# Altium schematic sheet BQ25570.SchDoc: BQ25570 Schematic
size A4; DrawnBy: Shuran Xu; SheetNumber: 5; SheetTotal: 8
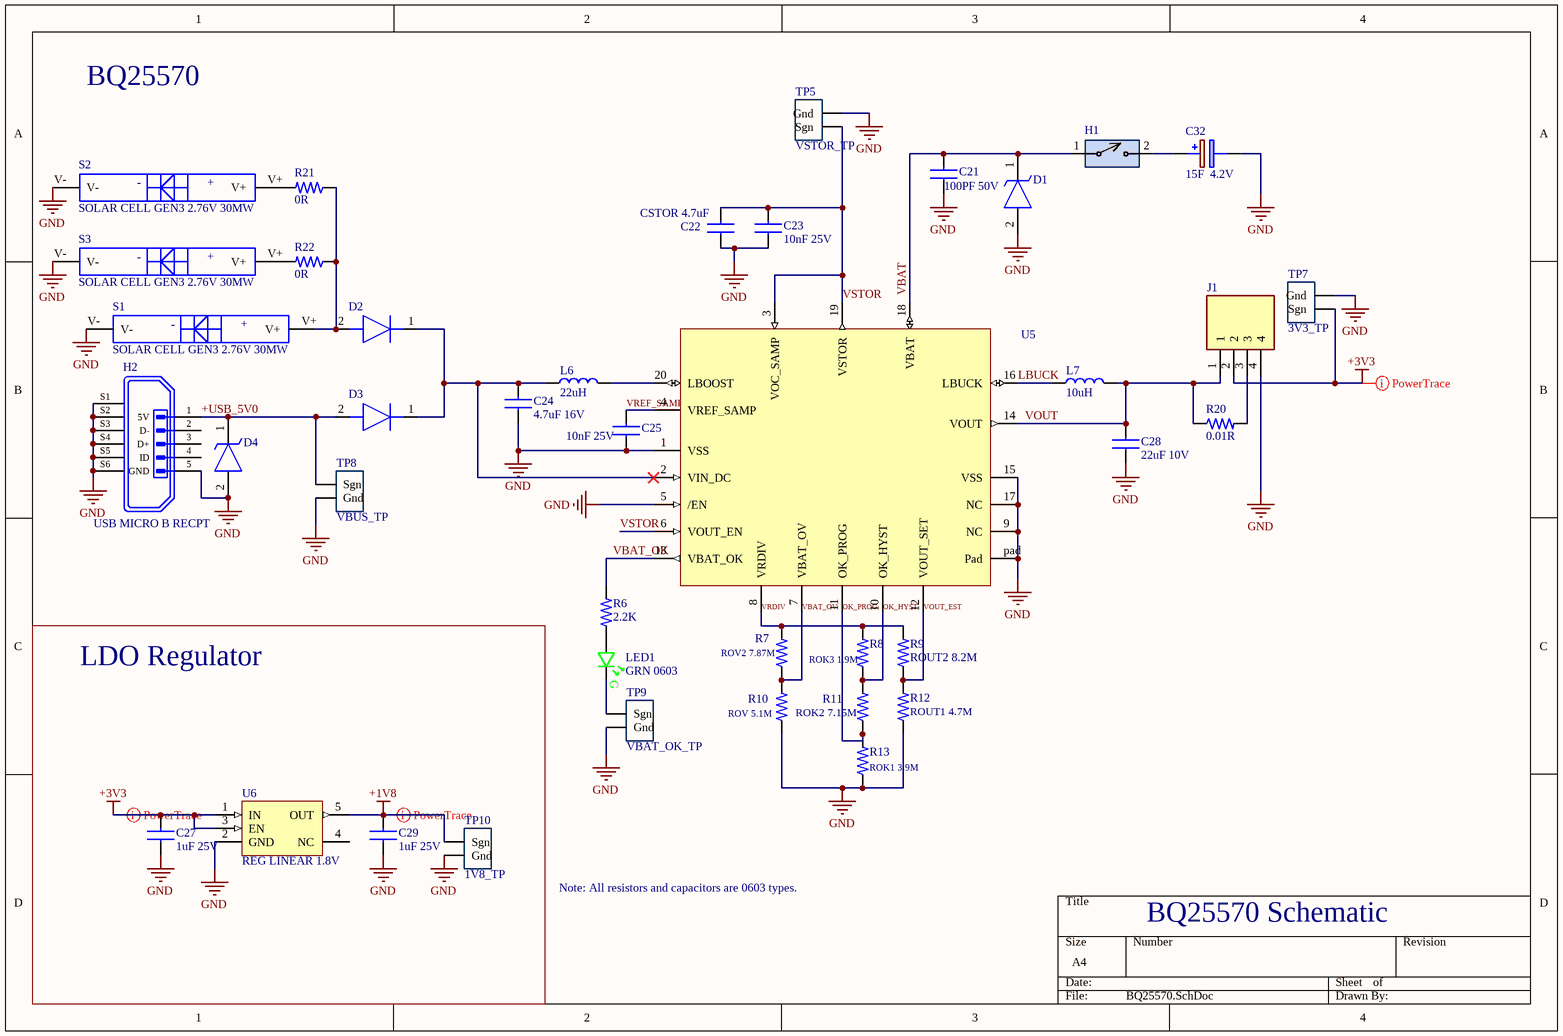
[diagram p0: BQ25570.SchDoc]

## Parts
C21  100PF 50V  [Chip2Pin_1.6x0.8x0.9_CAP]
C22  CSTOR 4.7uF  [Chip2Pin_CAP_2_1.6x0.8]
C23  10nF 25V  [Chip2Pin_1.6x0.8x0.9_CAP]
C24  4.7uF 16V  [Chip2Pin_1.6x0.8x0.9_CAP]
C25  10nF 25V  [Chip2Pin_1.6x0.8x0.9_CAP]
C27  1uF 25V  [Chip2Pin_1.6x0.8x0.9_CAP]
C28  22uF 10V  [CAP_0603_1MM]
C29  1uF 25V  [Chip2Pin_1.6x0.8x0.9_CAP]
C32  15F  4.2V  [MAL219691204E3]
D1  TVS DIODE 5.5VWM 12VC SOD923  [SODFL1006X40N]  (value not drawn)
D2  DIODE SCHOTTKY 10V 3A SOD323-2  [SOD2513X110N]  (value not drawn)
D3  DIODE SCHOTTKY 10V 3A SOD323-2  [SOD2513X110N]  (value not drawn)
D4  TVS DIODE 5.5VWM 12VC SOD923  [SODFL1006X40N]  (value not drawn)
H1  CONN HEADER VERT 2POS 2.54MM  [2-PIN_MALE_HEADER_01-IN]  (value not drawn)
H2  USB MICRO B RECPT  [MICROUSB_AMPHENOL_10118194-0001LF]
J1  Headers & Wire Housings 4P SINGLE ROW  [HDRV4W63P0X254_1X4_1016X250X950P]  (value not drawn)
L6  22uH  [IND_3030x12]
L7  10uH  [IND_2828x30]
LED1  GRN 0603  [LED_0603_GRN_WL-SMCW]
R6  2.2K  [RES_0603_1608X06]
R7  ROV2 7.87M  [RES_0603_1608X06]
R8  ROK3 1.9M  [RES_0603_1608X06]
R9  ROUT2 8.2M  [RES_0603_1608X06]
R10  ROV 5.1M  [RES_0603_1608X06]
R11  ROK2 7.15M  [RES_0603_1608X06]
R12  ROUT1 4.7M  [RES_0603_1608X06]
R13  ROK1 3.9M  [RES_0603_1608X06]
R20  0.01R  [RES_0603_1608X06]
R21  0R  [RES_0603_1608X06]
R22  0R  [RES_0603_1608X06]
S1  SOLAR CELL GEN3 2.76V 30MW  [KXOB25-03X4F]
S2  SOLAR CELL GEN3 2.76V 30MW  [KXOB25-03X4F]
S3  SOLAR CELL GEN3 2.76V 30MW  [KXOB25-03X4F]
TP5  VSTOR_TP  [TP10x_Probe]
TP7  3V3_TP  [TP10x_Probe]
TP8  VBUS_TP  [TP10x_Probe]
TP9  VBAT_OK_TP  [TP10x_Probe]
TP10  1V8_TP  [TP10x_Probe]
U5  IC ENERGY HARV CTRLR BATT 20VQFN  [QFN_20_3.5X3.5]  (value not drawn)
U6  REG LINEAR 1.8V  [SOT23_5_2.9X1.6]

## Blocks framed on the sheet
LDO Regulator: C27 C29 TP10 U6

## Nets
+1V8: C29.1 TP10.1(Sgn) U6.5(OUT)
+3V3: C27.1 J1.2 TP7.1(Sgn) U6.1(IN) U6.3(EN)
GND: C21.2 C22.2 C23.2 C24.2 C25.2 C27.2 C28.2 C29.2 C32.2(-) D1.2(A) D4.2(A) H2.5(GND) H2.S1 H2.S2 H2.S3 H2.S4 H2.S5 H2.S6 J1.4 R10.1 R12.1 R13.1 S1.V- S2.V- S3.V- TP5.2(Gnd) TP7.2(Gnd) TP8.2(Gnd) TP9.2(Gnd) TP10.2(Gnd) U5.1(VSS) U5.5(/EN) U5.9(NC) U5.15(VSS) U5.17(NC) U5.pad(Pad) U6.2(GND)
+USB_5V0: D3.2(A) D4.1(K) H2.1(5V) TP8.1(Sgn)
LBUCK: L7.1 U5.16(LBUCK)
OK_HYST: R8.1 R11.2 U5.10(OK_HYST)
OK_PROG: R11.1 R13.2 U5.11(OK_PROG)
VBAT: C21.1 D1.1(K) H1.1 U5.18(VBAT)
VBAT_OK: R6.2 U5.13(VBAT_OK)
VBAT_OV: R7.1 R10.2 U5.7(VBAT_OV)
VOUT: C28.1 J1.1 L7.2 R20.1 U5.14(VOUT)
VOUT_EST: R9.1 R12.2 U5.12(VOUT_SET)
VRDIV: R7.2 R8.2 R9.2 U5.8(VRDIV)
VREF_SAMP: C25.1 U5.4(VREF_SAMP)
VSTOR: C22.1 C23.1 TP5.1(Sgn) U5.3(VOC_SAMP) U5.6(VOUT_EN) U5.19(VSTOR)
NetC24_1: C24.1 D2.1(K) D3.1(K) L6.1 U5.2(VIN_DC)
NetC32_1: C32.1(+) H1.2
NetD2_2: D2.2(A) R21.1 R22.1 S1.V+
NetJ1_3: J1.3 R20.2
NetL6_2: L6.2 U5.20(LBOOST)
NetLED1_A: LED1.A R6.1
NetLED1_C: LED1.C TP9.1(Sgn)
NetR21_2: R21.2 S2.V+
NetR22_2: R22.2 S3.V+

Not connected (* = marked no-connect by the designer): H2 2(D-) 3(D+) 4(ID); U6 4(NC)

## Layout directives
rule Width Constraint [Pref Width = 20mil    Min Width = 10mil    Max Width = 20mil]: +1V8, +3V3

## Notes on the sheet
- BQ25570
- Note: All resistors and capacitors are 0603 types.
- (in symbol 150060GS75000) G
- (in symbol KXOB25-03X4F-TR) -; +

## Library data of the parts
C21 = GRM1885C1H101JA01J: 0603 100 pF 50 V ±5% Tolerance C0G SMT Multilayer Ceramic Capacitor; Manufacturer: Murata; Supplier 1: Arrow Electronics; Manufacturer Part Number: GRM1885C1H101JA01J; RoHS: Yes; Category: Ceramic Capacitors; Stock 1: 97512; Pricing 1: 1=0.01350 (USD); Mounting Technology: Surface Mount; Case/Package: 0603; Case Code (Imperial): 0603; Case Code (Metric): 1608; Min Operating Temperature: -55°C; Max Operating Temperature: 125°C; Value: 100pF; Voltage Rating: 50V; Voltage Rating (DC): 50V; Tolerance: 5%; Packaging: Tape and Reel; Package Quantity: 10000; Dielectric: C0G; Termination: SMD/SMT; Voltage: 50V; Series: GRM; Construction: Flat; Length: 1.6mm; Width: 0.8mm; Height: 0.8mm; Thickness: 0.035inch; Depth: 0.8mm; Size: 0.8mm; Radiation Hardening: No; Lead Free: Lead Free; RoHS Compliant: Yes; ComponentLink1URL: https://datasheet.ciiva.com/19467/1856644-19467772.pdf?src-supplier=Jameco; ComponentLink1Description: https://datasheet.ciiva.com/19467/1856644-19467772.pdf?src-supplier=Jameco; ComponentLink2URL: https://datasheet.ciiva.com/18100/getdatasheetpartid-26824-18100644.pdf?src-supplier=Verical; ComponentLink2Description: https://datasheet.ciiva.com/18100/getdatasheetpartid-26824-18100644.pdf?src-supplier=Verical; ComponentLink3URL: https://datasheet.ciiva.com/45259/partnumbering-e-01-45259466.pdf?src-supplier=Digi-Key; ComponentLink3Description: https://datasheet.ciiva.com/45259/partnumbering-e-01-45259466.pdf?src-supplier=Digi-Key; ComponentLink4URL: https://datasheet.ciiva.com/11605/product-11605547.pdf?src-supplier=Avnet; ComponentLink4Description: https://datasheet.ciiva.com/11605/product-11605547.pdf?src-supplier=Avnet; ComponentLink5URL: https://datasheet.ciiva.com/164/partnumbering-e-01-164252.pdf?src-supplier=Digi-Key; ComponentLink5Description: https://datasheet.ciiva.com/164/partnumbering-e-01-164252.pdf?src-supplier=Digi-Key
C22 C24 = GRM188Z71C475KE21D: Cap Ceramic 4.7uF 16V X7R 10% SMD 0603 125°C Paper T/R; Manufacturer: Murata; Supplier 1: Arrow Electronics; Manufacturer Part Number: GRM188Z71C475KE21D; RoHS: Yes; Category: Ceramic Capacitors; Stock 1: 80000; Pricing 1: 4000=0.05770, 8000=0.04270 (USD); RoHS Compliant: Yes
C23 C25 = GRT1885C1E103JA02J: Multi-Layer Ceramic Capacitor 0.01uF 25VDC C0G 5% 0603 Paper T/R; Manufacturer: Murata; Supplier 1: Future Electronics; Manufacturer Part Number: GRT1885C1E103JA02J; RoHS: Yes; Category: Ceramic Capacitors; Stock 1: 130000; Pricing 1: 10000=0.02340, 20000=0.02280, 30000=0.02250, 50000=0.02210, 100000=0.02130 (USD)
C27 C29 = GCM188R71E105KA64J: Cap Ceramic 1uF 25V X7R 10% Pad SMD 0603 125C Automotive T/R; Manufacturer: Murata; Supplier 1: Arrow Electronics; Manufacturer Part Number: GCM188R71E105KA64J; RoHS: Yes; Category: Ceramic Capacitors; Stock 1: 30000; Pricing 1: 10000=0.03520, 20000=0.03290, 30000=0.03110, 50000=0.03040, 100000=0.02490, 250000=0.02380 (USD); Mounting Technology: Surface Mount; Case/Package: 0603; Case Code (Imperial): 0603; Case Code (Metric): 1608; Weight: 0.000222oz; Min Operating Temperature: -55°C; Max Operating Temperature: 125°C; Value: 1uF; Tolerance: 10%; Dielectric: X7R; Packaging: Tape and Reel; Voltage Rating: 25V; Termination: SMD/SMT; Voltage Rating (DC): 25V; Package Quantity: 10000; Length: 1.6mm; Width: 0.8mm; Height: 0.8mm; Thickness: 0.035inch; Depth: 0.8mm; Ratings: AEC-Q200; Radiation Hardening: No; RoHS Compliant: Yes; ComponentLink1URL: http://www.mouser.com/ds/2/281/c03e-806517.pdf?src-supplier=Mouser; ComponentLink1Description: http://www.mouser.com/ds/2/281/c03e-806517.pdf?src-supplier=Mouser; ComponentLink2URL: http://www.murata.com/~/media/webrenewal/support/library/catalog/products/capacitor/mlcc/c03e.ashx?src-supplier=Digi-Key; ComponentLink2Description: http://www.murata.com/~/media/webrenewal/support/library/catalog/products/capacitor/mlcc/c03e.ashx?src-supplier=Digi-Key
C28 = GRM188R61A226ME15D: 22uF 10V X5R 0603; Manufacturer: Murata; Voltage Rating DC: 10 VDC; Tolerance: 20 %; Brand: Murata Electronics; Type: Voltage and Temperature Derating Recommended Product; Unit Weight: 0.000222 oz; Supplier 1: Digi-Key; Supplier Part Number 1: 490-10476-1-ND; Manufacturer Part Number: GRM188R61A226ME15D; Stock 1: 849458; Pricing 1: 1=0.33, 10=0.226, 50=0.1506, 100=0.1279, 500=0.0903, 1000=0.079 (USD); Product Category: Multilayer Ceramic Capacitors MLCC - SMD/SMT; RoHS: True; Capacitance: 22 uF; Dielectric: X5R; Case Code - in: 0603; Case Code - mm: 1608; Height: 0.8 mm; Maximum Operating Temperature: + 85 C; Minimum Operating Temperature: - 55 C; Product: General Type MLCCs; Series: GRM; Packaging: Reel; Length: 1.6 mm; Package / Case: 0603 (1608 metric); Factory Pack Quantity: 4000; Termination Style: SMD/SMT; Width: 0.8 mm; ComponentLink1URL: http://www.farnell.com/datasheets/2047978.pdf?src-supplier=Element14; ComponentLink1Description: http://www.farnell.com/datasheets/2047978.pdf?src-supplier=Element14
C32 = MAL219691253E3: Supercapacitors / Ultracapacitors 15F 4.2V 22x24x2.5 3pin Sur Mount Flat
D1 D4 = D5V0M1U2S9-7: ESD Suppressors / TVS Diodes Bi-Directional 35pF Dataline Protection; Number of Unidirectional Channels: 1; Reverse Standoff Voltage: 5.5V; Min Breakdown Voltage: 6.2V; Clamping Voltage: 12V; Peak Pulse Power: 108W; Power Line Protection: No; Peak Pulse Current: 9A; Supplier 1: Arrow Electronics; Manufacturer: Diodes; Manufacturer Part Number: D5V0M1U2S9-7; RoHS: Yes; Category: TVS Diodes; Stock 1: 75890; Pricing 1: 1=0.24290, 10=0.18040, 100=0.10220, 500=0.06670, 1000=0.04280, 2000=0.03710, 5000=0.03470, 10000=0.02760, 30000=0.02740, 50000=0.02710, 100000=0.02240 (USD); Mounting Technology: Surface Mount; Min Operating Temperature: -65°C; Max Operating Temperature: 150°C; Packaging: Tape and Reel; Resistor Type: Zener; RoHS Compliant: Yes; ComponentLink1URL: http://www.mouser.com/ds/2/115/D5V0M1U2S9-756882.pdf?src-supplier=Mouser; ComponentLink1Description: http://www.mouser.com/ds/2/115/D5V0M1U2S9-756882.pdf?src-supplier=Mouser; ComponentLink2URL: https://www.diodes.com/assets/Datasheets/D5V0M1U2S9.pdf?src-supplier=Digi-Key; ComponentLink2Description: https://www.diodes.com/assets/Datasheets/D5V0M1U2S9.pdf?src-supplier=Digi-Key
D2 D3 = BAT60AE6327HTSA1: Manufacturer: Infineon; Element Configuration: Single; Forward Voltage: 370mV; Peak Non-Repetitive Surge Current: 5A; Polarity: Standard; Supplier 1: Newark; Manufacturer Part Number: BAT60AE6327HTSA1; RoHS: Yes; Category: Rectifier Diodes; Stock 1: 57000; Pricing 1: 3000=0.08300, 6000=0.08100, 12000=0.07900, 18000=0.07600, 24000=0.07500 (USD); Mounting Technology: Surface Mount; Case/Package: SOD-323-2; Pins: 2; Contact Plating: Tin; Min Operating Temperature: -55°C; Max Operating Temperature: 85°C; Packaging: Tape and Reel; Forward Current: 3A; Max Repetitive Reverse Voltage (Vrrm): 10V; Average Rectified Current: 3A; Max Reverse Voltage (DC): 10V; Series: Automotive, AEC-Q101; Voltage Rating (DC): 10V; Current Rating: 3A; Output Current: 3A; Radiation Hardening: No; Reach SVHC Compliant: Yes; Lead Free: Lead Free; Halogen Free: Not Halogen Free; RoHS Compliant: Yes; ComponentLink1URL: https://datasheet.ciiva.com/8300/infineon-bat60aseries-ds-v01-01-en-8300325.pdf?src-supplier=Avnet; ComponentLink1Description: https://datasheet.ciiva.com/8300/infineon-bat60aseries-ds-v01-01-en-8300325.pdf?src-supplier=Avnet; ComponentLink2URL: https://datasheet.ciiva.com/26948/getdatasheetpartid-743048-26948826.pdf?src-supplier=Verical; ComponentLink2Description: https://datasheet.ciiva.com/26948/getdatasheetpartid-743048-26948826.pdf?src-supplier=Verical
H1 = PRPC002SAAN-RC: Manufacturer: Sullins; Number of Positions: 2; Connector Type: Male Pin; Pitch: 0.1inch; Supplier 1: Digi-Key; Manufacturer Part Number: PRPC002SAAN-RC; RoHS: Yes; Category: Connectors; Stock 1: 23200; Pricing 1: 1=0.08000, 10=0.07300, 25=0.05400, 50=0.04640, 100=0.04490, 250=0.03872, 500=0.03716 (USD); Mounting Technology: Through Hole; Color: Black; Contact Plating: Gold; Package Quantity: 1; Number of Rows: 1; Packaging: Bulk; Termination: Solder; Series: -; Contact Type: Male Pin; Contact Mating Length: 0.23inch; RoHS Compliant: Yes; ComponentLink1URL: https://datasheet.ciiva.com/741/xrxczzzsxxn-rc-st-11635-b-741243.pdf?src-supplier=Digi-Key; ComponentLink1Description: https://datasheet.ciiva.com/741/xrxczzzsxxn-rc-st-11635-b-741243.pdf?src-supplier=Digi-Key
H2 = 10118194-0001LF: USB - micro B USB 2.0 Receptacle Connector 5 Position Surface Mount, Right Angle; Through Hole; Manufacturer: Amphenol FCI; Number of Terminals/Pins: 5; Current Rating: 1.8A; Connector Type: USB,Receptacle; Insulation Resistance: 1GR; Number of Ports: 1; Max Voltage Rating (AC): 100V; Pitch: 0.65mm; Supplier 1: Digi-Key; Manufacturer Part Number: 10118194-0001LF; RoHS: Yes; Category: USB Connectors; Stock 1: 87961; Pricing 1: 1=0.48000, 10=0.45100, 25=0.38680, 50=0.32860, 100=0.31580, 250=0.28360, 500=0.27070 (USD); Mount: Surface Mount,Horizontal; Contact Material: Copper Alloy; Contact Plating: Gold; Housing Material: Polymer; Color: Black; Min Operating Temperature: -55°C; Max Operating Temperature: 85°C; Package Quantity: 9600; Packaging: Tape and Reel; Gender: Receptacle; Number of Contacts: 5; Termination: Solder; Orientation: Right Angle; Features: Shielded; Length: 8.05mm; Depth: 5mm; Radiation Hardening: No; Lead Free: Lead Free; Flammability Rating: UL94 V-0; ComponentLink1URL: https://datasheet.ciiva.com/4598/10118194ac-197217-4598807.pdf?src-supplier=Mouser; ComponentLink1Description: https://datasheet.ciiva.com/4598/10118194ac-197217-4598807.pdf?src-supplier=Mouser; ComponentLink2URL: https://datasheet.ciiva.com/26945/getdatasheetpartid-418619-26945695.pdf?src-supplier=Verical; ComponentLink2Description: https://datasheet.ciiva.com/26945/getdatasheetpartid-418619-26945695.pdf?src-supplier=Verical; ComponentLink3URL: https://datasheet.ciiva.com/851/10118194-851110.pdf?src-supplier=Digi-Key; ComponentLink3Description: https://datasheet.ciiva.com/851/10118194-851110.pdf?src-supplier=Digi-Key; ComponentLink4URL: https://datasheet.ciiva.com/851/10118194-851111.pdf?src-supplier=Digi-Key; ComponentLink4Description: https://datasheet.ciiva.com/851/10118194-851111.pdf?src-supplier=Digi-Key; Supplier Part Number 1: 609-4618-6-ND
J1 = 826629-4: Conn Unshrouded Header HDR 4 POS 2.54mm Solder ST Thru-Hole Automotive Carton; Manufacturer: TE Connectivity; Current Rating: 3A; Number of Poles: 4; Connector Type: Plug,Header,Pin; Gender: Male; Board Standoff: No (Without); High Speed Serial Data Connector: No; PCB Mount Retention: Without; PCB Mounting Orientation: Vertical; Contact Post Length: 0.1259inch; Pin Length: 6.7mm; Plating Thickness: 0.8um; Supplier 1: Arrow Electronics; Manufacturer Part Number: 826629-4; RoHS: Yes; Category: Headers and Wire Housings; Stock 1: 18169; Pricing 1: 1=0.42230, 10=0.33800, 100=0.30710, 500=0.28770, 1000=0.24440 (USD); Mounting Technology: Straddle Mount; Contact Material: Bronze; Color: Green; Contact Plating: Gold,Tin; Housing Color: Green; Housing Material: PBT; Contact Shape: Square; Contact Finish - Mating: GOLD; Insulation Material: PBT; Insulation Color: Green; Min Operating Temperature: -65°C; Max Operating Temperature: 105°C; Number of Rows: 1; Package Quantity: 1500; Packaging: Carton; Contact Gender: Male; Number of Positions: 4; Termination: Through Hole; Number of Contacts: 4; Orientation: Straight; Contact Protection: No (Without); Gasket: No (Without); High Temperature Housing: No; Keyed: No; Mating Alignment: No (Without); Mating Connector Lock: No (Without); Selectively Loaded: No (Without); Stabilizers: No (Without); Strain Relief: No (Without); Series: AMPMODU MOD II; Contact Type: Male Pin; Fastening Type: Pull; Length: 10.16mm; Lead Pitch: 2.54mm; Pitch: 2.54mm; Contact Mating Length: 6.7mm; Row Spacing: 2.54mm; Depth: 2.5mm; Radiation Hardening: No; Reach SVHC Compliant: Yes; Flammability Rating: UL94 V-0; ELV: Compliant; RoHS Compliant: Yes; ComponentLink1URL: https://datasheet.ciiva.com/11746/0900766b80d7c358-11746112.pdf?src-supplier=Rs; ComponentLink1Description: https://datasheet.ciiva.com/11746/0900766b80d7c358-11746112.pdf?src-supplier=Rs; ComponentLink2URL: https://datasheet.ciiva.com/29369/001094756-da-01-en-stiftleiste-1-reihig-0-0826629-4-29369584.pdf?src-supplier=Conrad; ComponentLink2Description: https://datasheet.ciiva.com/29369/001094756-da-01-en-stiftleiste-1-reihig-0-0826629-4-29369584.pdf?src-supplier=Conrad; ComponentLink3URL: https://datasheet.ciiva.com/14120/eh826629-draw-14120839.pdf?src-supplier=Distrelec; ComponentLink3Description: https://datasheet.ciiva.com/14120/eh826629-draw-14120839.pdf?src-supplier=Distrelec
L6 = 74404031220A: WE-LQS Series; Shielded Wire-wound SMD Inductor 22 µH Wire-Wound 740mA Idc; Manufacturer: Wurth Electronics; Saturation Current: 430mA; DC Resistance (DCR): 524mR; Self Resonant Frequency: 36MHz; Test Frequency: 100kHz; Tolerance: 20%; Supplier 1: Mouser; Manufacturer Part Number: 74404031220A; RoHS: Yes; Category: Fixed Inductors; Stock 1: 1300; Pricing 1: 1=1.16000, 10=1.16000, 50=0.96200, 100=0.89100, 1000=0.79700, 10000=0.64500 (USD); Mounting Technology: Surface Mount; Case/Package: Nonstandard; Min Operating Temperature: -40°C; Max Operating Temperature: 125°C; Packaging: Cut Tape; Resistor Type: Wirewound; Value: 22uH; Current Rating: 740mA; Shielding: Shielded; RMS Current (Irms): 740mA; Inductance Tolerance: 20%; Series: WE-LQS; Length: 0.118inch; Width: 0.118inch; Height - Seated (Max): 0.047inch; RoHS Compliant: Yes; ComponentLink1URL: http://www.farnell.com/datasheets/2039985.pdf?src-supplier=Element14; ComponentLink1Description: http://www.farnell.com/datasheets/2039985.pdf?src-supplier=Element14; ComponentLink2URL: https://katalog.we-online.de/pbs/datasheet/74404031220A.pdf?src-supplier=Digi-Key; ComponentLink2Description: https://katalog.we-online.de/pbs/datasheet/74404031220A.pdf?src-supplier=Digi-Key
L7 = 744029100: Power Choke Shielded Wirewound 10uH 30% 100KHz Ferrite 650mA 470mOhm DCR T/R; Manufacturer: Wurth Electronics; Self Resonant Frequency: 40MHz; Saturation Current: 500mA; Max DC Current: 800mA; DC Resistance (DCR): 470mR; ESR: 300mR; Supplier 1: Newark; Manufacturer Part Number: 744029100; RoHS: Yes; Category: Fixed Inductors; Stock 1: 480; Pricing 1: 1=1.69000, 10=1.64000, 25=1.55000, 50=1.45000, 100=1.37000, 250=1.34000, 500=1.29000 (USD); Mounting Technology: Surface Mount; Case/Package: Nonstandard; Pins: 2; Core Material: Ferrite; Weight: 0.001129oz; Min Operating Temperature: -40°C; Max Operating Temperature: 125°C; Packaging: Cut Tape; Package Quantity: 1; Series: WE-TPC; Tolerance: 30%; Shielding: Shielded; Inductance Tolerance: 30%; Value: 10uH; Current Rating: 650mA; Termination: SMD/SMT; Test Frequency: 100kHz; Resistor Type: Wirewound; RMS Current (Irms): 650mA; Length: 2.8mm; Width: 2.8mm; Height: 1.35mm; Height - Seated (Max): 0.059inch; Depth: 2.8mm; Lead Free: Lead Free; RoHS Compliant: Yes; ComponentLink1URL: https://datasheet.ciiva.com/5975/69360-5975061.pdf?src-supplier=Farnell; ComponentLink1Description: https://datasheet.ciiva.com/5975/69360-5975061.pdf?src-supplier=Farnell; ComponentLink2URL: https://datasheet.ciiva.com/4961/744029100-81254-4961409.pdf?src-supplier=Mouser; ComponentLink2Description: https://datasheet.ciiva.com/4961/744029100-81254-4961409.pdf?src-supplier=Mouser; ComponentLink3URL: https://datasheet.ciiva.com/6700/744029100-6700264.pdf?src-supplier=Digi-Key; ComponentLink3Description: https://datasheet.ciiva.com/6700/744029100-6700264.pdf?src-supplier=Digi-Key; ComponentLink4URL: https://datasheet.ciiva.com/11802/0900766b80d7f1cc-11802020.pdf?src-supplier=Rs; ComponentLink4Description: https://datasheet.ciiva.com/11802/0900766b80d7f1cc-11802020.pdf?src-supplier=Rs; ComponentLink5URL: https://datasheet.ciiva.com/7892/69360-7892549.pdf?src-supplier=Element14; ComponentLink5Description: https://datasheet.ciiva.com/7892/69360-7892549.pdf?src-supplier=Element14; ComponentLink6URL: https://datasheet.ciiva.com/22702/69360-22702631.pdf?src-supplier=Element14; ComponentLink6Description: https://datasheet.ciiva.com/22702/69360-22702631.pdf?src-supplier=Element14; ComponentLink7URL: https://datasheet.ciiva.com/6700/744029100-6700266.pdf?src-supplier=Digi-Key; ComponentLink7Description: https://datasheet.ciiva.com/6700/744029100-6700266.pdf?src-supplier=Digi-Key
LED1 = 150060GS75000: LED, 0603, GREEN, 430MCD, 520NM; Manufacturer: Wurth Electronics; Dynamic Catalog: 0603 Rectangle with Flat Top Chip LEDs; 3D Model: SMCW_0603.igs / SMCW_0603.stp / SMCW_0603.wrl; Wavelength - Peak: 515nm; Voltage - Forward (Vf) (Typ): 3.2V; Current - Test: 20mA; Viewing Angle: 140°; Lens Type: Clear; Lens Style/Size: Rectangle with Flat Top, 1.1mm x 0.7mm; Other Names: 732-4971-2; Supplier 1: Digi-Key; Manufacturer Part Number: 150060GS75000; Stock 1: 34964; Pricing 1: 1=0.14, 50=0.129, 100=0.11, 500=0.095 (USD); Standard Package: 4,000; Category: Optoelectronics; Family: LED Indication - Discrete; Series: WL-SMCW; Packaging: Tape & Reel (TR); Color: Green; Wavelength - Dominant: 520nm; Millicandela Rating: 430mcd; Package / Case: 0603 (1608 Metric); Size / Dimension: 1.60mm L x 0.80mm W; Height: 0.70mm; Mounting Type: Surface Mount; Online Catalog: 0603 Rectangle with Flat Top Chip LEDs; ComponentLink1URL: https://katalog.we-online.de/led/datasheet/150060GS75000.pdf?src-supplier=Digi-Key; ComponentLink1Description: https://katalog.we-online.de/led/datasheet/150060GS75000.pdf?src-supplier=Digi-Key; ComponentLink2URL: http://www.produktinfo.conrad.com/datenblaetter/750000-774999/759427-da-01-en-CHIPLED_0603_W_KL_GRUEN_150060GS75000.pdf?src-supplier=Conrad; ComponentLink2Description: http://www.produktinfo.conrad.com/datenblaetter/750000-774999/759427-da-01-en-CHIPLED_0603_W_KL_GRUEN_150060GS75000.pdf?src-supplier=Conrad; Supplier Part Number 1: 732-4971-1-ND
R6 = RC0603FR-072K2L: Res Thick Film 0603 2.2K Ohm 1% 0.1W(1/10W) ±100ppm/°C Pad SMD T/R; Manufacturer: Yageo; Value: 2.2kR; Power Rating: 100mW; Voltage Rating: 50V; Supplier 1: Future Electronics; Manufacturer Part Number: RC0603FR-072K2L; RoHS: Yes; Category: Chip SMD Resistors; Stock 1: 1981; Pricing 1: 1=0.10000, 20=0.06610, 100=0.04800, 500=0.02980, 2500=0.01160 (USD); Case/Package: 0603; Case Code (Imperial): 0603; Case Code (Metric): 1608; Min Operating Temperature: -55°C; Max Operating Temperature: 155°C; Tolerance: 1%; Packaging: Tape and Reel; Package Quantity: 1; Termination: SMD/SMT; Resistor Type: Thick Film; Number of Terminations: 2; Temperature Coefficient: 100ppm/°C; Max Power Dissipation: 100mW; Features: Moisture Resistant; Series: RC; Resistance Tolerance: 1%; Construction: Rectangular; Length: 1.6mm; Width: 0.031inch; Height: 0.022inch; Depth: 0.8mm; Lead Free: Lead Free; RoHS Compliant: Yes; Military Standard: Not; ComponentLink1URL: https://datasheet.ciiva.com/2453/pyu-r-int-thick-7-2453943.pdf?src-supplier=Digi-Key; ComponentLink1Description: https://datasheet.ciiva.com/2453/pyu-r-int-thick-7-2453943.pdf?src-supplier=Digi-Key; ComponentLink2URL: https://datasheet.ciiva.com/2453/pyu-r-int-thick-7-2453944.pdf?src-supplier=Digi-Key; ComponentLink2Description: https://datasheet.ciiva.com/2453/pyu-r-int-thick-7-2453944.pdf?src-supplier=Digi-Key; ComponentLink3URL: https://datasheet.ciiva.com/2453/pyu-r-int-thick-7-2453945.pdf?src-supplier=Digi-Key; ComponentLink3Description: https://datasheet.ciiva.com/2453/pyu-r-int-thick-7-2453945.pdf?src-supplier=Digi-Key; ComponentLink4URL: https://datasheet.ciiva.com/7660/1868787-7660791.pdf?src-supplier=Element14; ComponentLink4Description: https://datasheet.ciiva.com/7660/1868787-7660791.pdf?src-supplier=Element14; ComponentLink5URL: https://datasheet.ciiva.com/46394/443971-46394958.pdf?src-supplier=Element14; ComponentLink5Description: https://datasheet.ciiva.com/46394/443971-46394958.pdf?src-supplier=Element14; ComponentLink6URL: https://datasheet.ciiva.com/46440/1868787-46440902.pdf?src-supplier=Element14; ComponentLink6Description: https://datasheet.ciiva.com/46440/1868787-46440902.pdf?src-supplier=Element14
R7 = RC0603FR-077M87L: Res Thick Film 0603 7.87M Ohm 1% 1/10W ±100ppm/°C Molded SMD SMD Paper T/R; Manufacturer: Yageo; Value: 7.87MR; Power Rating: 100mW; Voltage Rating: 50V; Supplier 1: Mouser; Manufacturer Part Number: RC0603FR-077M87L; RoHS: Yes; Category: Chip SMD Resistors; Stock 1: 31065; Pricing 1: 1=0.10000, 10=0.02500, 50=0.02500, 100=0.01100, 1000=0.00500, 10000=0.00200 (USD); Case/Package: 0603; Contact Plating: Tin,Matte; Case Code (Imperial): 0603; Case Code (Metric): 1608; Min Operating Temperature: -55°C; Max Operating Temperature: 155°C; Tolerance: 1%; Resistor Type: Thick Film; Temperature Coefficient: 100ppm/°C; Packaging: Tape and Reel; Termination: SMD/SMT; Number of Terminations: 2; Max Power Dissipation: 100mW; Features: Moisture Resistant; Series: RC; Length: 0.063inch; Width: 0.8mm; Height: 0.022inch; Radiation Hardening: No; RoHS Compliant: Yes; ComponentLink1URL: http://www.mouser.com/ds/2/447/RC0603-272842.pdf?src-supplier=Mouser; ComponentLink1Description: http://www.mouser.com/ds/2/447/RC0603-272842.pdf?src-supplier=Mouser; ComponentLink2URL: http://www.yageo.com/documents/recent/PYu-RC_Group_51_RoHS_L_2.pdf?src-supplier=Avnet; ComponentLink2Description: http://www.yageo.com/documents/recent/PYu-RC_Group_51_RoHS_L_2.pdf?src-supplier=Avnet; ComponentLink3URL: http://www.yageo.com.tw/exep/pages/download/literatures/PYu-R_INT-thick_7.pdf?src-supplier=Digi-Key; ComponentLink3Description: http://www.yageo.com.tw/exep/pages/download/literatures/PYu-R_INT-thick_7.pdf?src-supplier=Digi-Key
R8 = RC0603FR-071M91L: Res Thick Film 0603 1.91M Ohm 1% 1/10W ±100ppm/°C Molded SMD SMD Paper T/R; Manufacturer: Yageo; Power Rating: 100mW; Value: 1.91MR; Voltage Rating: 50V; Supplier 1: Future Electronics; Manufacturer Part Number: RC0603FR-071M91L; RoHS: Yes; Category: Chip SMD Resistors; Stock 1: 20000; Pricing 1: 5000=0.00190, 50000=0.00180, 200000=0.00170, 625000=0.00160, 2000000=0.00150 (USD); Case/Package: 0603; Case Code (Imperial): 0603; Case Code (Metric): 1608; Contact Plating: Tin,Matte; Min Operating Temperature: -55°C; Max Operating Temperature: 155°C; Packaging: Tape and Reel; Tolerance: 1%; Resistor Type: Thick Film; Number of Terminations: 2; Termination: SMD/SMT; Max Power Dissipation: 100mW; Temperature Coefficient: 100ppm/°C; Features: Moisture Resistant; Series: RC; Construction: Rectangular; Length: 1.6mm; Width: 0.031inch; Height: 0.022inch; Depth: 0.8mm; Radiation Hardening: No; Military Standard: Not; RoHS Compliant: Yes; ComponentLink1URL: https://datasheet.ciiva.com/12576/rc0603-272842-12576073.pdf?src-supplier=Mouser; ComponentLink1Description: https://datasheet.ciiva.com/12576/rc0603-272842-12576073.pdf?src-supplier=Mouser; ComponentLink2URL: https://datasheet.ciiva.com/8894/pyu-rc0603-51-rohs-l-4-8894859.pdf?src-supplier=Avnet; ComponentLink2Description: https://datasheet.ciiva.com/8894/pyu-rc0603-51-rohs-l-4-8894859.pdf?src-supplier=Avnet
R9 = RC0603JR-078M2L: Res Thick Film 0603 8.2M Ohm 5% 1/10W ±100ppm/°C Molded SMD SMD Paper T/R; Manufacturer: Yageo; Value: 8.2MR; Power Rating: 100mW; Voltage Rating: 50V; Supplier 1: Future Electronics; Manufacturer Part Number: RC0603JR-078M2L; RoHS: Yes; Category: Chip SMD Resistors; Stock 1: 195000; Pricing 1: 5000=0.00120, 75000=0.00110, 200000=0.00100, 750000=0.00100, 2000000=0.00090 (USD); Case/Package: 0603; Contact Plating: Tin,Matte; Case Code (Imperial): 0603; Case Code (Metric): 1608; Min Operating Temperature: -55°C; Max Operating Temperature: 155°C; Tolerance: 5%; Resistor Type: Thick Film; Temperature Coefficient: 100ppm/°C; Package Quantity: 1; Packaging: Tape and Reel; Termination: SMD/SMT; Number of Terminations: 2; Max Power Dissipation: 100mW; Voltage Rating (DC): 50V; Features: Moisture Resistant; Series: RC; Construction: Rectangular; Length: 1.6mm; Width: 0.8mm; Height: 0.022inch; Depth: 0.8mm; Radiation Hardening: No; Military Standard: Not; Lead Free: Lead Free; RoHS Compliant: Yes; ComponentLink1URL: https://datasheet.ciiva.com/2453/pyu-r-int-thick-7-2453230.pdf?src-supplier=Digi-Key; ComponentLink1Description: https://datasheet.ciiva.com/2453/pyu-r-int-thick-7-2453230.pdf?src-supplier=Digi-Key; ComponentLink2URL: https://datasheet.ciiva.com/2453/pyu-r-int-thick-7-2453231.pdf?src-supplier=Digi-Key; ComponentLink2Description: https://datasheet.ciiva.com/2453/pyu-r-int-thick-7-2453231.pdf?src-supplier=Digi-Key; ComponentLink3URL: https://datasheet.ciiva.com/2453/pyu-r-int-thick-7-2453229.pdf?src-supplier=Digi-Key; ComponentLink3Description: https://datasheet.ciiva.com/2453/pyu-r-int-thick-7-2453229.pdf?src-supplier=Digi-Key; ComponentLink4URL: https://datasheet.ciiva.com/12561/rc0603-272842-12561446.pdf?src-supplier=Mouser; ComponentLink4Description: https://datasheet.ciiva.com/12561/rc0603-272842-12561446.pdf?src-supplier=Mouser
R10 = RC0603JR-075M1L: Res Thick Film 0603 5.1M Ohm 5% 0.1W(1/10W) ±100ppm/°C Pad SMD T/R; Manufacturer: Yageo; Value: 5.1MR; Power Rating: 100mW; Voltage Rating: 50V; Supplier 1: Future Electronics; Manufacturer Part Number: RC0603JR-075M1L; RoHS: Yes; Category: Chip SMD Resistors; Stock 1: 40000; Pricing 1: 5000=0.00120, 75000=0.00110, 200000=0.00100, 750000=0.00100, 2000000=0.00090 (USD); Case/Package: 0603; Contact Plating: Tin,Matte,Lead; Case Code (Metric): 1608; Case Code (Imperial): 0603; Min Operating Temperature: -55°C; Max Operating Temperature: 155°C; Tolerance: 5%; Resistor Type: Thick Film; Temperature Coefficient: 100ppm/°C; Package Quantity: 1; Packaging: Tape and Reel; Number of Terminations: 2; Termination: SMD/SMT; Max Power Dissipation: 100mW; Voltage Rating (DC): 50V; Features: Moisture Resistant; Series: RC; Construction: Rectangular; Length: 1.6mm; Width: 0.031inch; Height: 0.022inch; Depth: 0.8mm; Radiation Hardening: No; Military Standard: Not; Lead Free: Lead Free; RoHS Compliant: Yes; ComponentLink1URL: https://datasheet.ciiva.com/2518/pyu-r-int-thick-7-2518836.pdf?src-supplier=Digi-Key; ComponentLink1Description: https://datasheet.ciiva.com/2518/pyu-r-int-thick-7-2518836.pdf?src-supplier=Digi-Key; ComponentLink2URL: https://datasheet.ciiva.com/2518/pyu-r-int-thick-7-2518837.pdf?src-supplier=Digi-Key; ComponentLink2Description: https://datasheet.ciiva.com/2518/pyu-r-int-thick-7-2518837.pdf?src-supplier=Digi-Key; ComponentLink3URL: https://datasheet.ciiva.com/2518/pyu-r-int-thick-7-2518835.pdf?src-supplier=Digi-Key; ComponentLink3Description: https://datasheet.ciiva.com/2518/pyu-r-int-thick-7-2518835.pdf?src-supplier=Digi-Key
R11 = RC0603FR-077M15L: Res Thick Film 0603 7.15M Ohm 1% 1/10W ±100ppm/°C Molded SMD SMD Paper T/R; Manufacturer: Yageo; Value: 7.15MR; Power Rating: 100mW; Voltage Rating: 50V; Supplier 1: Mouser; Manufacturer Part Number: RC0603FR-077M15L; RoHS: Yes; Category: Chip SMD Resistors; Stock 1: 25147; Pricing 1: 1=0.10000, 10=0.02500, 50=0.02500, 100=0.01100, 1000=0.00500, 10000=0.00300 (USD); Case/Package: 0603; Contact Plating: Tin,Matte; Case Code (Imperial): 0603; Case Code (Metric): 1608; Min Operating Temperature: -55°C; Max Operating Temperature: 155°C; Tolerance: 1%; Resistor Type: Thick Film; Temperature Coefficient: 100ppm/°C; Packaging: Tape and Reel; Number of Terminations: 2; Termination: SMD/SMT; Max Power Dissipation: 100mW; Features: Moisture Resistant; Series: RC; Construction: Rectangular; Length: 1.6mm; Width: 0.031inch; Height: 0.022inch; Depth: 0.8mm; Radiation Hardening: No; Military Standard: Not; RoHS Compliant: Yes; ComponentLink1URL: https://datasheet.ciiva.com/12560/rc0603-272842-12560523.pdf?src-supplier=Mouser; ComponentLink1Description: https://datasheet.ciiva.com/12560/rc0603-272842-12560523.pdf?src-supplier=Mouser
R12 = RC0603JR-074M7L: Res 4.7 MOhms ±5% 0.1W, 1/10W Chip Resistor 0603 (1608 Metric) Moisture Resistant Thick Film; Manufacturer: Yageo; Value: 4.7MR; Power Rating: 100mW; Voltage Rating: 50V; Temperature Coefficient: 100ppm/°C; Resistance Tolerance: 1%; Supplier 1: Arrow Electronics; Manufacturer Part Number: RC0603JR-074M7L; RoHS: Yes; Category: Chip SMD Resistors; Stock 1: 65000; Pricing 1: 5000=0.00090 (USD); Case/Package: 0603; Case Code (Metric): 1608; Case Code (Imperial): 0603; Contact Plating: Tin,Matte,Lead; Min Operating Temperature: -55°C; Max Operating Temperature: 155°C; Tolerance: 5%; Packaging: Tape and Reel; Package Quantity: 5000; Resistor Type: Thick Film; Number of Terminations: 2; Termination: SMD/SMT; Max Power Dissipation: 100mW; Voltage Rating (DC): 50V; Features: Moisture Resistant; Series: RC0603; Construction: Rectangular; Length: 1.6mm; Width: 0.031inch; Height: 0.022inch; Depth: 0.8mm; Radiation Hardening: No; Military Standard: Not; Lead Free: Lead Free; RoHS Compliant: Yes; ComponentLink1URL: https://datasheet.ciiva.com/2518/pyu-r-int-thick-7-2518833.pdf?src-supplier=Digi-Key; ComponentLink1Description: https://datasheet.ciiva.com/2518/pyu-r-int-thick-7-2518833.pdf?src-supplier=Digi-Key; ComponentLink2URL: https://datasheet.ciiva.com/2518/pyu-r-int-thick-7-2518834.pdf?src-supplier=Digi-Key; ComponentLink2Description: https://datasheet.ciiva.com/2518/pyu-r-int-thick-7-2518834.pdf?src-supplier=Digi-Key; ComponentLink3URL: https://datasheet.ciiva.com/2518/pyu-r-int-thick-7-2518832.pdf?src-supplier=Digi-Key; ComponentLink3Description: https://datasheet.ciiva.com/2518/pyu-r-int-thick-7-2518832.pdf?src-supplier=Digi-Key; Supplier 2: Newark; Stock 2: 10000; Pricing 2: 10=0.04200, 25=0.03400, 50=0.02500, 100=0.01700 (USD); Weight: 7.1E-05oz; ComponentLink4URL: https://datasheet.ciiva.com/9059/dcrcwe3-9059421.pdf?src-supplier=Avnet; ComponentLink4Description: https://datasheet.ciiva.com/9059/dcrcwe3-9059421.pdf?src-supplier=Avnet; ComponentLink5URL: https://datasheet.ciiva.com/5542/dcrcwe3-109170-5542876.pdf?src-supplier=Mouser; ComponentLink5Description: https://datasheet.ciiva.com/5542/dcrcwe3-109170-5542876.pdf?src-supplier=Mouser; ComponentLink6URL: https://datasheet.ciiva.com/2494/dcrcwe3-2494708.pdf?src-supplier=Digi-Key; ComponentLink6Description: https://datasheet.ciiva.com/2494/dcrcwe3-2494708.pdf?src-supplier=Digi-Key; ComponentLink7URL: https://datasheet.ciiva.com/2494/dcrcwe3-2494709.pdf?src-supplier=Digi-Key; ComponentLink7Description: https://datasheet.ciiva.com/2494/dcrcwe3-2494709.pdf?src-supplier=Digi-Key; ComponentLink8URL: https://datasheet.ciiva.com/2494/dcrcwe3-2494710.pdf?src-supplier=Digi-Key; ComponentLink8Description: https://datasheet.ciiva.com/2494/dcrcwe3-2494710.pdf?src-supplier=Digi-Key; ComponentLink9URL: https://datasheet.ciiva.com/7792/1700796-7792409.pdf?src-supplier=Element14; ComponentLink9Description: https://datasheet.ciiva.com/7792/1700796-7792409.pdf?src-supplier=Element14; ComponentLink10URL: https://datasheet.ciiva.com/7748/1697337-7748703.pdf?src-supplier=Element14; ComponentLink10Description: https://datasheet.ciiva.com/7748/1697337-7748703.pdf?src-supplier=Element14; ComponentLink11URL: https://datasheet.ciiva.com/16435/dcrcwe3-16435959.pdf?src-supplier=Future+Electronics; ComponentLink11Description: https://datasheet.ciiva.com/16435/dcrcwe3-16435959.pdf?src-supplier=Future+Electronics; ComponentLink12URL: https://datasheet.ciiva.com/22704/1697337-22704014.pdf?src-supplier=Element14; ComponentLink12Description: https://datasheet.ciiva.com/22704/1697337-22704014.pdf?src-supplier=Element14
R13 = RC0603JR-073M9L: Res Thick Film 0603 3.9M Ohm 5% 1/10W ±100ppm/°C Molded SMD SMD Paper T/R; Manufacturer: Yageo; Power Rating: 100mW; Value: 3.9MR; Voltage Rating: 50V; Supplier 1: Future Electronics; Manufacturer Part Number: RC0603JR-073M9L; RoHS: Yes; Category: Chip SMD Resistors; Stock 1: 1145000; Pricing 1: 5000=0.00180, 75000=0.00170, 250000=0.00160, 750000=0.00150, 2500000=0.00140 (USD); Case/Package: 0603; Case Code (Imperial): 0603; Case Code (Metric): 1608; Contact Plating: Tin,Matte; Min Operating Temperature: -55°C; Max Operating Temperature: 155°C; Packaging: Tape and Reel; Tolerance: 5%; Package Quantity: 1; Termination: SMD/SMT; Resistor Type: Thick Film; Number of Terminations: 2; Temperature Coefficient: 100ppm/°C; Max Power Dissipation: 100mW; Voltage Rating (DC): 50V; Features: Moisture Resistant; Series: RC; Construction: Rectangular; Length: 1.6mm; Width: 0.8mm; Height: 0.022inch; Depth: 0.8mm; Radiation Hardening: No; Military Standard: Not; Lead Free: Lead Free; RoHS Compliant: Yes; ComponentLink1URL: https://datasheet.ciiva.com/2508/pyu-r-int-thick-7-2508283.pdf?src-supplier=Digi-Key; ComponentLink1Description: https://datasheet.ciiva.com/2508/pyu-r-int-thick-7-2508283.pdf?src-supplier=Digi-Key; ComponentLink2URL: https://datasheet.ciiva.com/2508/pyu-r-int-thick-7-2508284.pdf?src-supplier=Digi-Key; ComponentLink2Description: https://datasheet.ciiva.com/2508/pyu-r-int-thick-7-2508284.pdf?src-supplier=Digi-Key; ComponentLink3URL: https://datasheet.ciiva.com/2508/pyu-r-int-thick-7-2508282.pdf?src-supplier=Digi-Key; ComponentLink3Description: https://datasheet.ciiva.com/2508/pyu-r-int-thick-7-2508282.pdf?src-supplier=Digi-Key
R20 = RL0603FR-070R01L: Res Thick Film 0603 0.01 Ohm 1% 0.1W(1/10W) ±1500ppm/°C Pad SMD Automotive T/R; Manufacturer: Yageo; Value: 10mR; Power Rating: 100mW; Voltage Rating: 50V; Supplier 1: Newark; Manufacturer Part Number: RL0603FR-070R01L; RoHS: Yes; Category: Chip SMD Resistors; Stock 1: 5000; Pricing 1: 1=0.67000, 25=0.49700, 50=0.35300, 100=0.20900 (USD); Case/Package: 0603; Pins: 2; Case Code (Imperial): 0603; Case Code (Metric): 1608; Contact Plating: Tin,Matte; Weight: 7.1E-05oz; Min Operating Temperature: -55°C; Max Operating Temperature: 125°C; Tolerance: 1%; Voltage Rating (DC): 50V; Packaging: Tape and Reel; Resistor Type: Thick Film; Termination: SMD/SMT; Temperature Coefficient: 1500ppm/°C; Package Quantity: 5000; Features: Moisture Resistant,Automotive AEC-Q200; Series: RL; Max Power Dissipation: 100mW; Number of Terminations: 2; Technology: THICK FILM; Resistance Tolerance: 1%; Construction: Rectangular; Length: 1.6mm; Width: 0.8mm; Height: 0.45mm; Depth: 0.8mm; Lead Pitch: 0.25mm; Ratings: AEC-Q200; Radiation Hardening: No; Military Standard: Not; Lead Free: Lead Free; RoHS Compliant: Yes; ComponentLink1URL: https://datasheet.ciiva.com/15328/pyu-rl-521-rohs-l-5-15328428.pdf?src-supplier=Mouser; ComponentLink1Description: https://datasheet.ciiva.com/15328/pyu-rl-521-rohs-l-5-15328428.pdf?src-supplier=Mouser; ComponentLink2URL: https://datasheet.ciiva.com/7746/877049-7746570.pdf?src-supplier=Element14; ComponentLink2Description: https://datasheet.ciiva.com/7746/877049-7746570.pdf?src-supplier=Element14; ComponentLink3URL: https://datasheet.ciiva.com/7746/877049-7746571.pdf?src-supplier=Element14; ComponentLink3Description: https://datasheet.ciiva.com/7746/877049-7746571.pdf?src-supplier=Element14; ComponentLink4URL: https://datasheet.ciiva.com/8891/pyu-rl-521-rohs-l-5-8891322.pdf?src-supplier=Avnet; ComponentLink4Description: https://datasheet.ciiva.com/8891/pyu-rl-521-rohs-l-5-8891322.pdf?src-supplier=Avnet
R21 R22 = RC0603FR-070RL: RC Series 0603 0.1 W 0 Ohm Jumper Surface Mount Thick Film Chip Resistor; Manufacturer: Yageo; Value: 0mR; Power Rating: 100mW; Tolerance: 1%; Voltage Rating: 50V; Temperature Coefficient: 200ppm/°C; Current Rating: 1A; Working Voltage: 75V; Supplier 1: Future Electronics; Manufacturer Part Number: RC0603FR-070RL; RoHS: Yes; Category: Chip SMD Resistors; Stock 1: 3525000; Pricing 1: 5000=0.00170, 25000=0.00160, 150000=0.00150, 500000=0.00140, 1500000=0.00130 (USD); Case/Package: 0603; Pins: 2; Case Code (Metric): 1608; Case Code (Imperial): 0603; Contact Plating: Tin,Matte; Min Operating Temperature: -55°C; Max Operating Temperature: 155°C; Packaging: Tape and Reel; Package Quantity: 5000; Resistor Type: Thick Film; Number of Terminations: 2; Termination: SMD/SMT; Max Power Dissipation: 100mW; Voltage Rating (DC): 50V; Features: Moisture Resistant; Series: RC; Construction: Rectangular; Resistance Tolerance: 1%; Technology: THICK FILM; Length: 1.6mm; Width: 0.8mm; Height: 0.45mm; Depth: 0.8mm; Radiation Hardening: No; Reach SVHC Compliant: Yes; Military Standard: Not; Lead Free: Lead Free; RoHS Compliant: Yes; ComponentLink1URL: https://datasheet.ciiva.com/11808/0900766b80f96399-11808172.pdf?src-supplier=Rs; ComponentLink1Description: https://datasheet.ciiva.com/11808/0900766b80f96399-11808172.pdf?src-supplier=Rs; ComponentLink2URL: https://datasheet.ciiva.com/5684/443971-5684699.pdf?src-supplier=Farnell; ComponentLink2Description: https://datasheet.ciiva.com/5684/443971-5684699.pdf?src-supplier=Farnell; ComponentLink3URL: https://datasheet.ciiva.com/7983/443971-7983627.pdf?src-supplier=Element14; ComponentLink3Description: https://datasheet.ciiva.com/7983/443971-7983627.pdf?src-supplier=Element14; ComponentLink4URL: https://datasheet.ciiva.com/22643/1868787-22643388.pdf?src-supplier=Element14; ComponentLink4Description: https://datasheet.ciiva.com/22643/1868787-22643388.pdf?src-supplier=Element14
S1-S3 = KXOB25-03X4F-TR: Manufacturer: ANYSOLAR; Supplier 1: Digi-Key; Manufacturer Part Number: KXOB25-03X4F-TR; RoHS: No; Category: Uncategorized; Stock 1: 896; Pricing 1: 1=3.08000, 10=2.61300, 50=2.33320, 100=2.21310, 250=2.07980, 500=1.97314 (USD)
TP5 TP7-TP10 = 10X_Test_Probe
U5 = BQ25570RGRR: Switching Battery Charger Li-Ion/Li-Pol/Supercapacitor 110mA 2.2V to 5.5V 20-Pin VQFN EP T/R; Manufacturer: Texas Instruments; Operating Supply Voltage: 4V; Output Current: 100mA; Operating Supply Current: 488nA; Switching Frequency: 1MHz; Supplier 1: Arrow Electronics; Manufacturer Part Number: BQ25570RGRR; RoHS: Yes; Category: Battery Management; Stock 1: 2940; Pricing 1: 1=7.05760, 10=6.56190, 25=6.32270, 100=5.81790, 250=5.63390, 500=5.29690, 1000=5.06460 (USD); Mounting Technology: Surface Mount; Case/Package: VQFN; Pins: 20; Contact Plating: Gold; Min Operating Temperature: -40°C; Max Operating Temperature: 125°C; Packaging: Tape and Reel; Package Quantity: 3000; RoHS Compliant: Yes; Lead Free: Lead Free; ComponentLink1URL: https://datasheet.ciiva.com/29590/bq25570-29590060.pdf?src-supplier=Digi-Key; ComponentLink1Description: https://datasheet.ciiva.com/29590/bq25570-29590060.pdf?src-supplier=Digi-Key
U6 = LP5907MFX-1.8/NOPB: Linear Voltage Regulator IC Positive Fixed 1 Output 1.8V 250mA SOT-23; Manufacturer: Texas Instruments; Min Input Voltage: 2.2V; Number of Outputs: 1; Dropout Voltage: 250mV; Max Supply Voltage: 5.5V; Quiescent Current: 25uA; Output Voltage Accuracy: 2%; Power Supply Rejection Ratio (PSRR): 60dB; Max Supply Current: 425uA; Supplier 1: Arrow Electronics; Manufacturer Part Number: LP5907MFX-1.8/NOPB; RoHS: Yes; Category: Voltage Regulators - Linear; Stock 1: 2558; Pricing 1: 1=0.67500, 10=0.57790, 25=0.54520, 100=0.40890, 250=0.39250, 500=0.33020, 1000=0.25370 (USD); Mounting Technology: Surface Mount; Case/Package: SOT-23-5; Pins: 5; Contact Plating: Tin; Min Operating Temperature: -40°C; Max Operating Temperature: 125°C; Packaging: Tape and Reel; Package Quantity: 3000; Output Voltage: 1.8V; Output Current: 250mA; Number of Regulators: 1; Nominal Output Voltage: 1.8V; Polarity: Positive; Accuracy: 2%; Max Output current: 250mA; Output Type: Fixed; Series: -; Output Configuration: Positive; Min Output Voltage: 1.8V; Reach SVHC Compliant: Yes; Lead Free: Lead Free; RoHS Compliant: Yes; ComponentLink1URL: https://datasheet.ciiva.com/15083/lp5907-15083594.pdf?src-supplier=Digi-Key; ComponentLink1Description: https://datasheet.ciiva.com/15083/lp5907-15083594.pdf?src-supplier=Digi-Key